# Altium schematic sheet BMS-S04-V02-Microcontroller.SchDoc
size A2
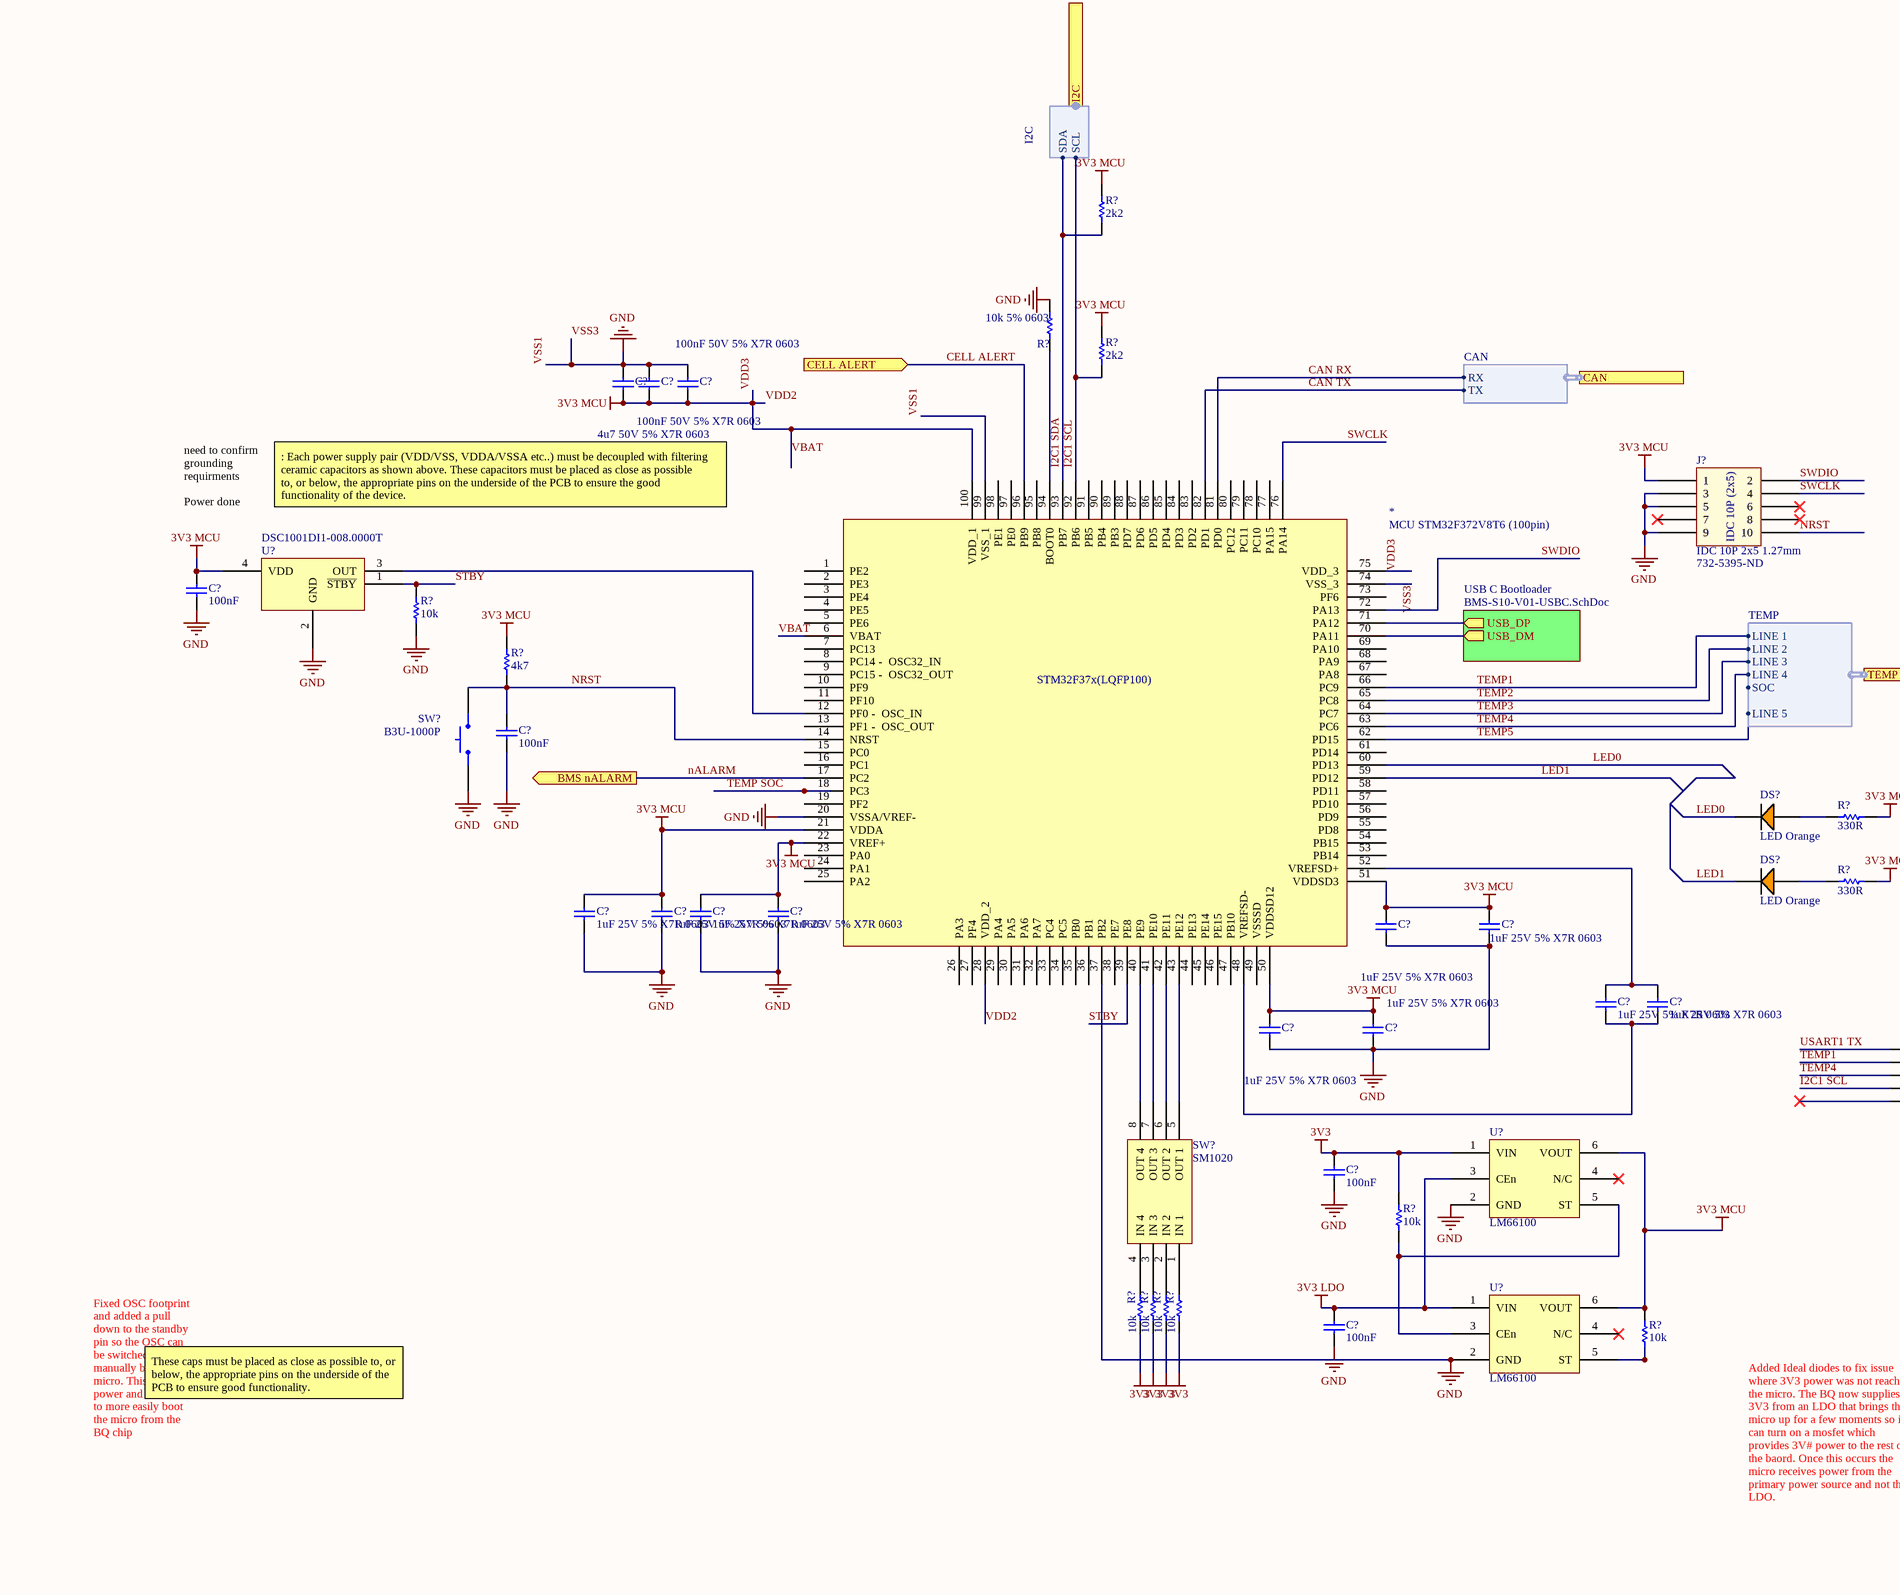
[diagram p0: BMS-S04-V02-Microcontroller.SchDoc, left]
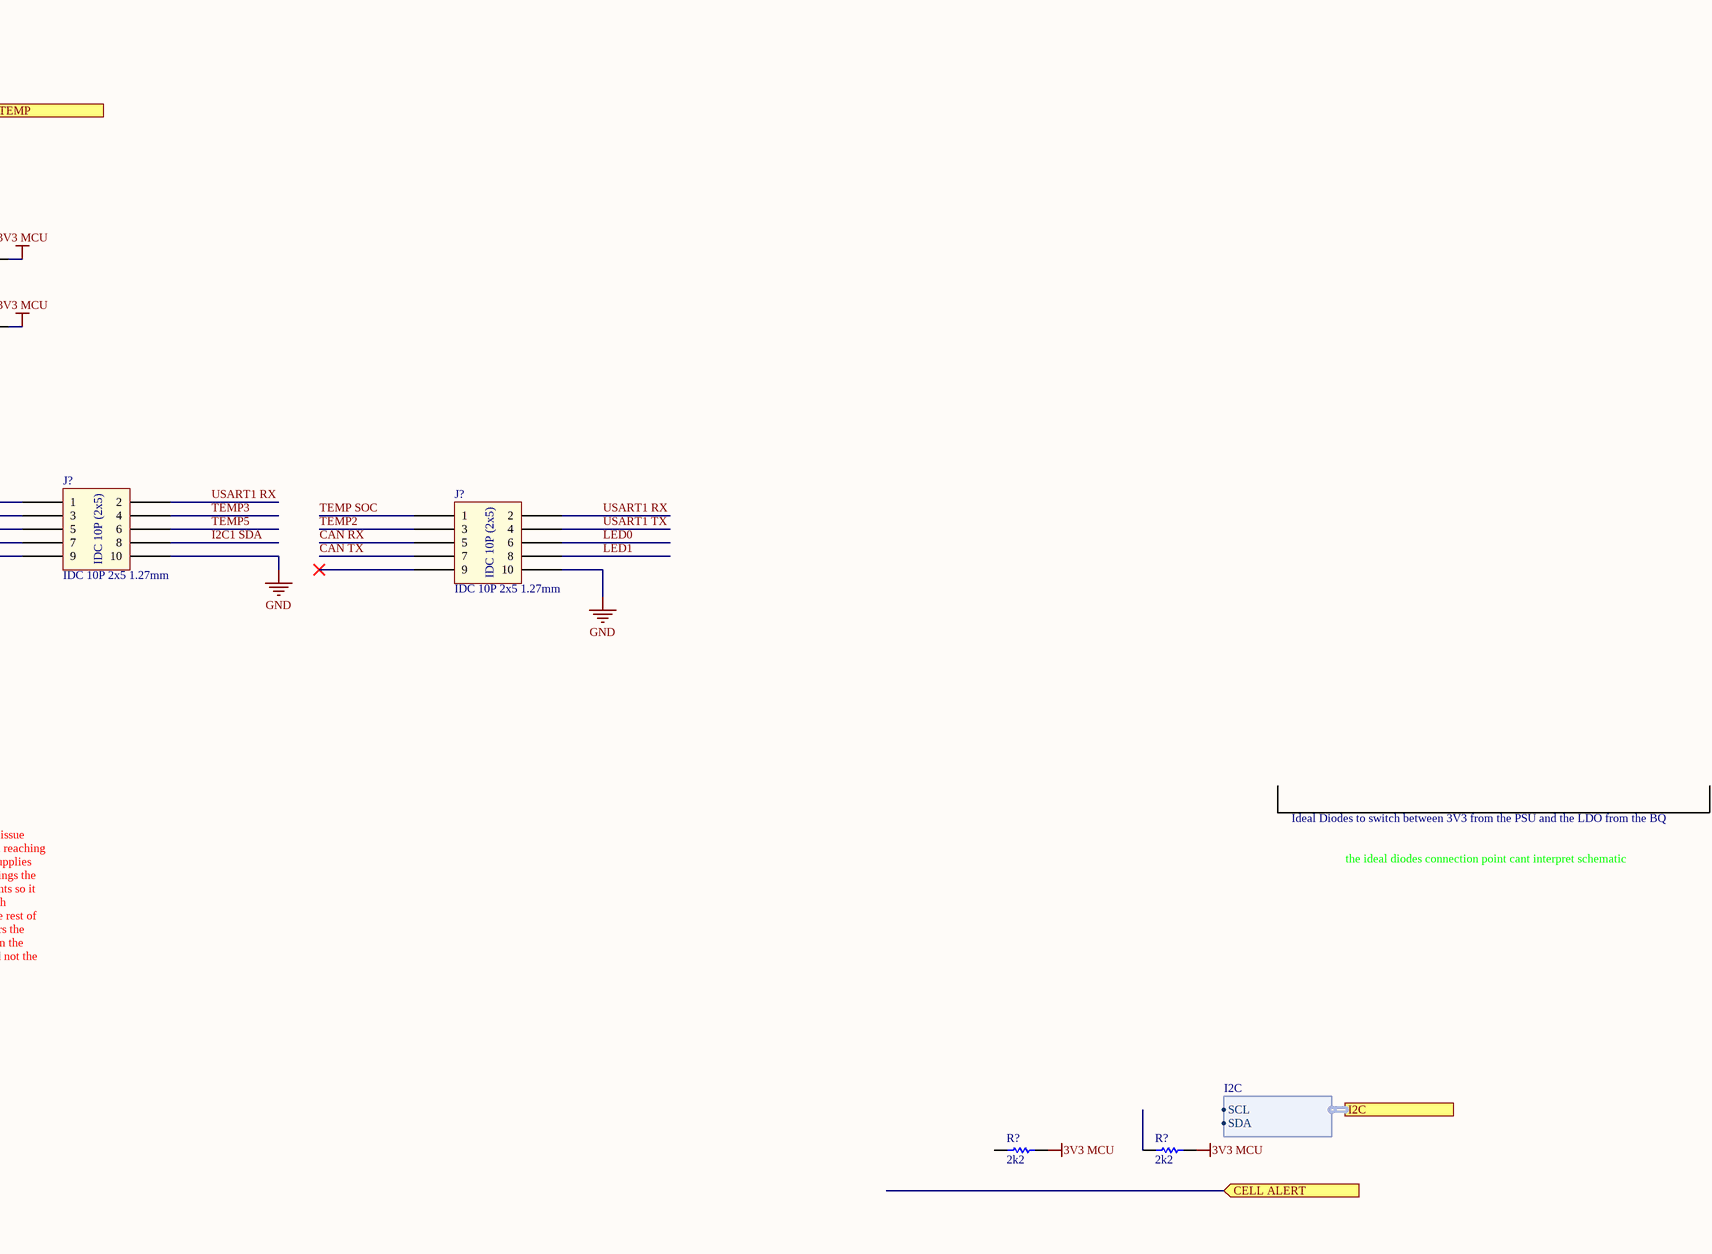
[diagram p1: BMS-S04-V02-Microcontroller.SchDoc, right]

## Parts
(Parts that share a designator on the sheet are numbered #1, #2 ... from top to bottom, then left to right.)
*  MCU STM32F372V8T6 (100pin)  [LQFP(100)]
C?#1  4u7 50V 5% X7R 0603  [Cap_Ceramic_0603]
C?#2  100nF 50V 5% X7R 0603  [Cap_Ceramic_0603]
C?#3  100nF 50V 5% X7R 0603  [Cap_Ceramic_0603]
C?#4  100nF  [Cap_Ceramic_0603]
C?#5  100nF  [Cap_Ceramic_0603]
C?#6  1uF 25V 5% X7R 0603  [Cap_Ceramic_0603]
C?#7  1uF 25V 5% X7R 0603  [Cap_Ceramic_0603]
C?#8  1uF 25V 5% X7R 0603  [Cap_Ceramic_0603]
C?#9  1uF 25V 5% X7R 0603  [Cap_Ceramic_0603]
C?#10  1uF 25V 5% X7R 0603  [Cap_Ceramic_0603]
C?#11  1uF 25V 5% X7R 0603  [Cap_Ceramic_0603]
C?#12  1uF 25V 5% X7R 0603  [Cap_Ceramic_0603]
C?#13  1uF 25V 5% X7R 0603  [Cap_Ceramic_0603]
C?#14  1uF 25V 5% X7R 0603  [Cap_Ceramic_0603]
C?#15  1uF 25V 5% X7R 0603  [Cap_Ceramic_0603]
C?#16  100nF  [Cap_Ceramic_0603]
C?#17  100nF  [Cap_Ceramic_0603]
DS?#1  LED Orange  [LED ORANGE 0603]
DS?#2  LED Orange  [LED ORANGE 0603]
J?#1  IDC 10P 2x5 1.27mm  [IDC 1.27MM 10P]
J?#2  IDC 10P 2x5 1.27mm  [IDC 1.27MM 10P]
J?#3  IDC 10P 2x5 1.27mm  [IDC 1.27MM 10P]
R?#1  2k2  [Res_ThinFilm_0603]
R?#2  10k 5% 0603  [Res_ThinFilm_0603]
R?#3  2k2  [Res_ThinFilm_0603]
R?#4  10k  [Res_ThinFilm_0603]
R?#5  4k7  [Res_ThinFilm_0603]
R?#6  330R  [Res_ThinFilm_0603]
R?#7  330R  [Res_ThinFilm_0603]
R?#8  10k  [Res_ThinFilm_0603]
R?#9  10k  [Res_ThinFilm_0603]
R?#10  10k  [Res_ThinFilm_0603]
R?#11  10k  [Res_ThinFilm_0603]
R?#12  10k  [Res_ThinFilm_0603]
R?#13  10k  [Res_ThinFilm_0603]
R?#14  2k2  [Res_ThinFilm_0603]
R?#15  2k2  [Res_ThinFilm_0603]
SW?#1  B3U-1000P  [BTN B3U-1000P]
SW?#2  SM1020  [SM1020]
U?#1  DSC1001DI1-008.0000T  [DSC1001DI1-008.0000TCT-ND]
U?#2  LM66100  [LM66100]
U?#3  LM66100  [LM66100]

## Sub-sheets
USB C Bootloader = BMS-S10-V01-USBC.SchDoc: USB_DP (out), USB_DM (out)

## Ports
BMS nALARM (out), CAN (harness CAN), CELL ALERT (in), I2C (harness I2C), TEMP (harness TEMP)

## Harnesses
I2C: SCL, SDA
TEMP: LINE 1, LINE 2, LINE 3, LINE 4, LINE 5, SOC
CAN: RX, TX

## Nets
3V3: C?#16.2 R?#8.2 R?#9.2 R?#10.2 R?#11.2 R?#12.2 U?#2.1(VIN)
3V3 LDO: C?#17.2 U?#2.3(CEn) U?#3.1(VIN)
VBAT: *.6(VBAT) *.21(VDDA) *.22(VREF+) *.28(VDD_2) *.50(VDDSD12) *.51(VDDSD3) *.75(VDD_3) *.100(VDD_1) C?#1.1 C?#2.1 C?#3.1 C?#4.2 C?#6.2 C?#7.2 C?#8.2 C?#9.2 C?#10.2 C?#11.2 C?#14.2 C?#15.2 J?#1.1 R?#1.2 R?#3.2 R?#5.2 R?#6.2 R?#7.2 R?#13.2 R?#14.2 R?#15.2 U?#1.4(VDD) U?#2.6(VOUT) U?#3.6(VOUT)  [also labelled 3V3 MCU, VDD2, VDD3]
VSS1: *.20(VSSA/VREF-) *.37(PB2) *.74(VSS_3) *.99(VSS_1) C?#1.2 C?#2.2 C?#3.2 C?#4.1 C?#5.1 C?#6.1 C?#7.1 C?#8.1 C?#9.1 C?#10.1 C?#11.1 C?#14.1 C?#15.1 C?#16.1 C?#17.1 J?#1.3 J?#1.5 J?#1.9 J?#2.10 J?#3.10 R?#2.2 R?#4.1 SW?#1.1 U?#1.2(GND) U?#2.2(GND) U?#3.2(GND)  [also labelled GND, VSS3]
CAN RX: *.81(PD0) J?#3.5 ; port CAN.RX
CAN TX: *.82(PD1) J?#3.7 ; port CAN.TX
CELL ALERT: *.96(PB9) ; port CELL ALERT
I2C1 SCL: *.92(PB6) J?#2.7 R?#3.1 ; port I2C.SCL
I2C1 SDA: *.93(PB7) J?#2.8 R?#1.1 ; port I2C.SDA
LED0: *.60(PD13) DS?#1.2(C) J?#3.6
LED1: *.59(PD12) DS?#2.2(C) J?#3.8
nALARM: *.17(PC2) ; port BMS nALARM
NRST: *.14(NRST) C?#5.2 J?#1.10 R?#5.1 SW?#1.2
STBY: *.39(PE8) R?#4.2 U?#1.1(~{STBY})
SWCLK: *.76(PA14) J?#1.4
SWDIO: *.72(PA13) J?#1.2
TEMP1: *.66(PC9) J?#2.3 ; port TEMP.LINE 1
TEMP2: *.65(PC8) J?#3.3 ; port TEMP.LINE 2
TEMP3: *.64(PC7) J?#2.4 ; port TEMP.LINE 3
TEMP4: *.63(PC6) J?#2.5 ; port TEMP.LINE 4
TEMP5: *.62(PD15) J?#2.6 ; port TEMP.LINE 5
TEMP SOC: *.18(PC3) J?#3.1 ; port TEMP.SOC
USART1 RX: J?#2.2 J?#3.2
USART1 TX: J?#2.1 J?#3.4
Net*_12: *.12(PF0_-__OSC_IN) U?#1.3(OUT)
Net*_40: *.40(PE9) SW?#2.8(OUT_4)
Net*_41: *.41(PE10) SW?#2.7(OUT_3)
Net*_42: *.42(PE11) SW?#2.6(OUT_2)
Net*_43: *.43(PE12) SW?#2.5(OUT_1)
Net*_48: *.48(VREFSD-) C?#12.2 C?#13.1
Net*_52: *.52(VREFSD+) C?#12.1 C?#13.2
Net*_70: *.70(PA11) ; sheet USB C Bootloader/USB_DM
Net*_71: *.71(PA12) ; sheet USB C Bootloader/USB_DP
Net*_94: *.94(BOOT0) R?#2.1
NetDS?#1_1: DS?#1.1(A) R?#6.1
NetDS?#2_1: DS?#2.1(A) R?#7.1
NetR?#8_1: R?#8.1 U?#2.5(ST) U?#3.3(CEn)
NetR?#9_1: R?#9.1 SW?#2.4(IN_4)
NetR?#10_1: R?#10.1 SW?#2.3(IN_3)
NetR?#11_1: R?#11.1 SW?#2.2(IN_2)
NetR?#12_1: R?#12.1 SW?#2.1(IN_1)
NetR?#13_1: R?#13.1 U?#3.5(ST)

Not connected (* = marked no-connect by the designer): * 1(PE2) 2(PE3) 3(PE4) 4(PE5) 5(PE6) 7(PC13) 8(PC14_-__OSC32_IN) 9(PC15_-__OSC32_OUT) 10(PF9) 11(PF10) 13(PF1_-__OSC_OUT) 15(PC0) 16(PC1) 19(PF2) 23(PA0) 24(PA1) 25(PA2) 26(PA3) 27(PF4) 29(PA4) 30(PA5) 31(PA6) 32(PA7) 33(PC4) 34(PC5) 35(PB0) 36(PB1) 38(PE7) 44(PE13) 45(PE14) 46(PE15) 47(PB10) 49(VSSSD) 53(PB14) 54(PB15) 55(PD8) 56(PD9) 57(PD10) 58(PD11) 61(PD14) 67(PA8) 68(PA9) 69(PA10) 73(PF6) 77(PA15) 78(PC10) 79(PC11) 80(PC12) 83(PD2) 84(PD3) 85(PD4) 86(PD5) 87(PD6) 88(PD7) 89(PB3) 90(PB4) 91(PB5) 95(PB8) 97(PE0) 98(PE1); J?#1 6* 7* 8*; J?#2 9*; J?#3 9*; R?#14 1; R?#15 1; U?#2 4(N/C)*; U?#3 4(N/C)*

## Notes on the sheet
- need to confirm grounding requirments
  Power done
- : Each power supply pair (VDD/VSS, VDDA/VSSA etc..) must be decoupled with filtering
  ceramic capacitors as shown above. These capacitors must be placed as close as possible
  to, or below, the appropriate pins on the underside of the PCB to ensure the good
  functionality of the device.
- (near J?#1) 732-5395-ND
- Ideal Diodes to switch between 3V3 from the PSU and the LDO from the BQ
- These caps must be placed as close as possible to, or below, the appropriate pins on the underside of the PCB to ensure good functionality.
- the ideal diodes connection point cant interpret schematic
- Fixed OSC footprint and added a pull down to the standby pin so the OSC can be switched on manually by the micro. This will save power and allow us to more easily boot the micro from the BQ chip
- Added Ideal diodes to fix issue where 3V3 power was not reaching the micro. The BQ now supplies 3V3 from an LDO that brings the micro up for a few moments so it can turn on a mosfet which provides 3V# power to the rest of the baord. Once this occurs the micro receives power from the primary power source and not the LDO.
- (in symbol IDC 10P 2x5 1.27mm) IDC 10P (2x5)
- (in symbol MCU STM32F372V8T6 (100pin)) STM32F37x(LQFP100)

## Library data of the parts
* = MCU STM32F372V8T6 (100pin): 100 pin MCU
C?#1 = 4u7 50V 5% X7R 0603: Capacitor, Ceramic, SMD, 4u7, 50V, 5%, X7R, 0603
C?#2-C?#5 C?#16 C?#17 = 100nF 50V 5% X7R 0603: Capacitor, Ceramic, SMD, 100nF, 50V, 5%, X7R, 0603
C?#6 C?#8 C?#10 C?#12 C?#14 = 10nF 50V 5% X7R 0603: Capacitor, Ceramic, SMD, 10nF, 50V, 5%, X7R, 0603
C?#7 C?#9 C?#13 = 1uF 25V 5% X7R 0603_1: Capacitor, Ceramic, SMD, 1uF, 25V, 5%, X7R, 0603
C?#11 C?#15 = 1uF 25V 5% X7R 0603: Capacitor, Ceramic, SMD, 1uF, 25V, 5%, X7R, 0603
DS?#1 DS?#2 = LED ORANGE 0603
R?#1 R?#3 R?#14 R?#15 = 2k2 5% 0603: Resistor, SMD, 2k2, 0.1W, 5%, 0603
R?#2 R?#4 R?#9-R?#12 = 10k 5% 0603: Resistor, SMD, 10k, 0.1W, 5%, 0603
R?#5 = 4k7 5% 0603: Resistor, SMD, 4k7, 0.1W, 5%, 0603
R?#6 R?#7 = 330R 5% 0603: Resistor, SMD, 330R, 0.1W, 5%, 0603
R?#8 R?#13 = 10k 1% 0603: Resistor, SMD, 10k, 0.1W, 1%, 0603
SW?#1 = BTN B3U-1000P: Omron B3U-1000P Ultra Miniture Switch; ComponentLink1Description: LCSC; ComponentLink1URL: https://lcsc.com/product-detail/Tactile-Switches_BRIGHT-TSA063G50-250_C294565.html
SW?#2 = SM1020: 4 Pin DIL Switch
U?#1 = DSC1001DI1-008.0000T: 8MHz XO (Standard) CMOS Oscillator 1.8 ~ 3.3V Standby (Power Down) 4-SMD, No Lead
U?#2 U?#3 = LM66100: Diode, SMD, 5.5V, 1.5A, SC-70; Manufacturer: ON Semiconductor / Fairchild; Manufacturer Part Number: 1N914BWS; Average Rectified Current: 150mA; Element Configuration: Single; Forward Voltage: 1V; Max Repetitive Reverse Voltage (Vrrm): 75V; Max Reverse Leakage Current: 5uA; Power Dissipation: 200mW; Recovery Time: 4ns; Max Forward Surge Current (Ifsm): 4A; Parameter 1: *; Weight: 0.0276g; Category: Rectifier Diodes; Contact Plating: Tin,Matte; Forward Current: 150mA; Lead Free: Lead Free; Max Operating Temperature: 150°C; Max Reverse Voltage (DC): 75V; Min Operating Temperature: -55°C; Mount: Surface Mount; Number of Pins: 2; Package Quantity: 1; Packaging: Tape and Reel; Peak Reverse Current: 5uA; Radiation Hardening: No; REACH SVHC: No SVHC; Reverse Recovery Time: 4ns; Height: 1mm; Length: 1.8mm; Reverse Voltage: 75V; Width: 1.35mm